# EAGLE design odbConnector (EAGLE 5.12)
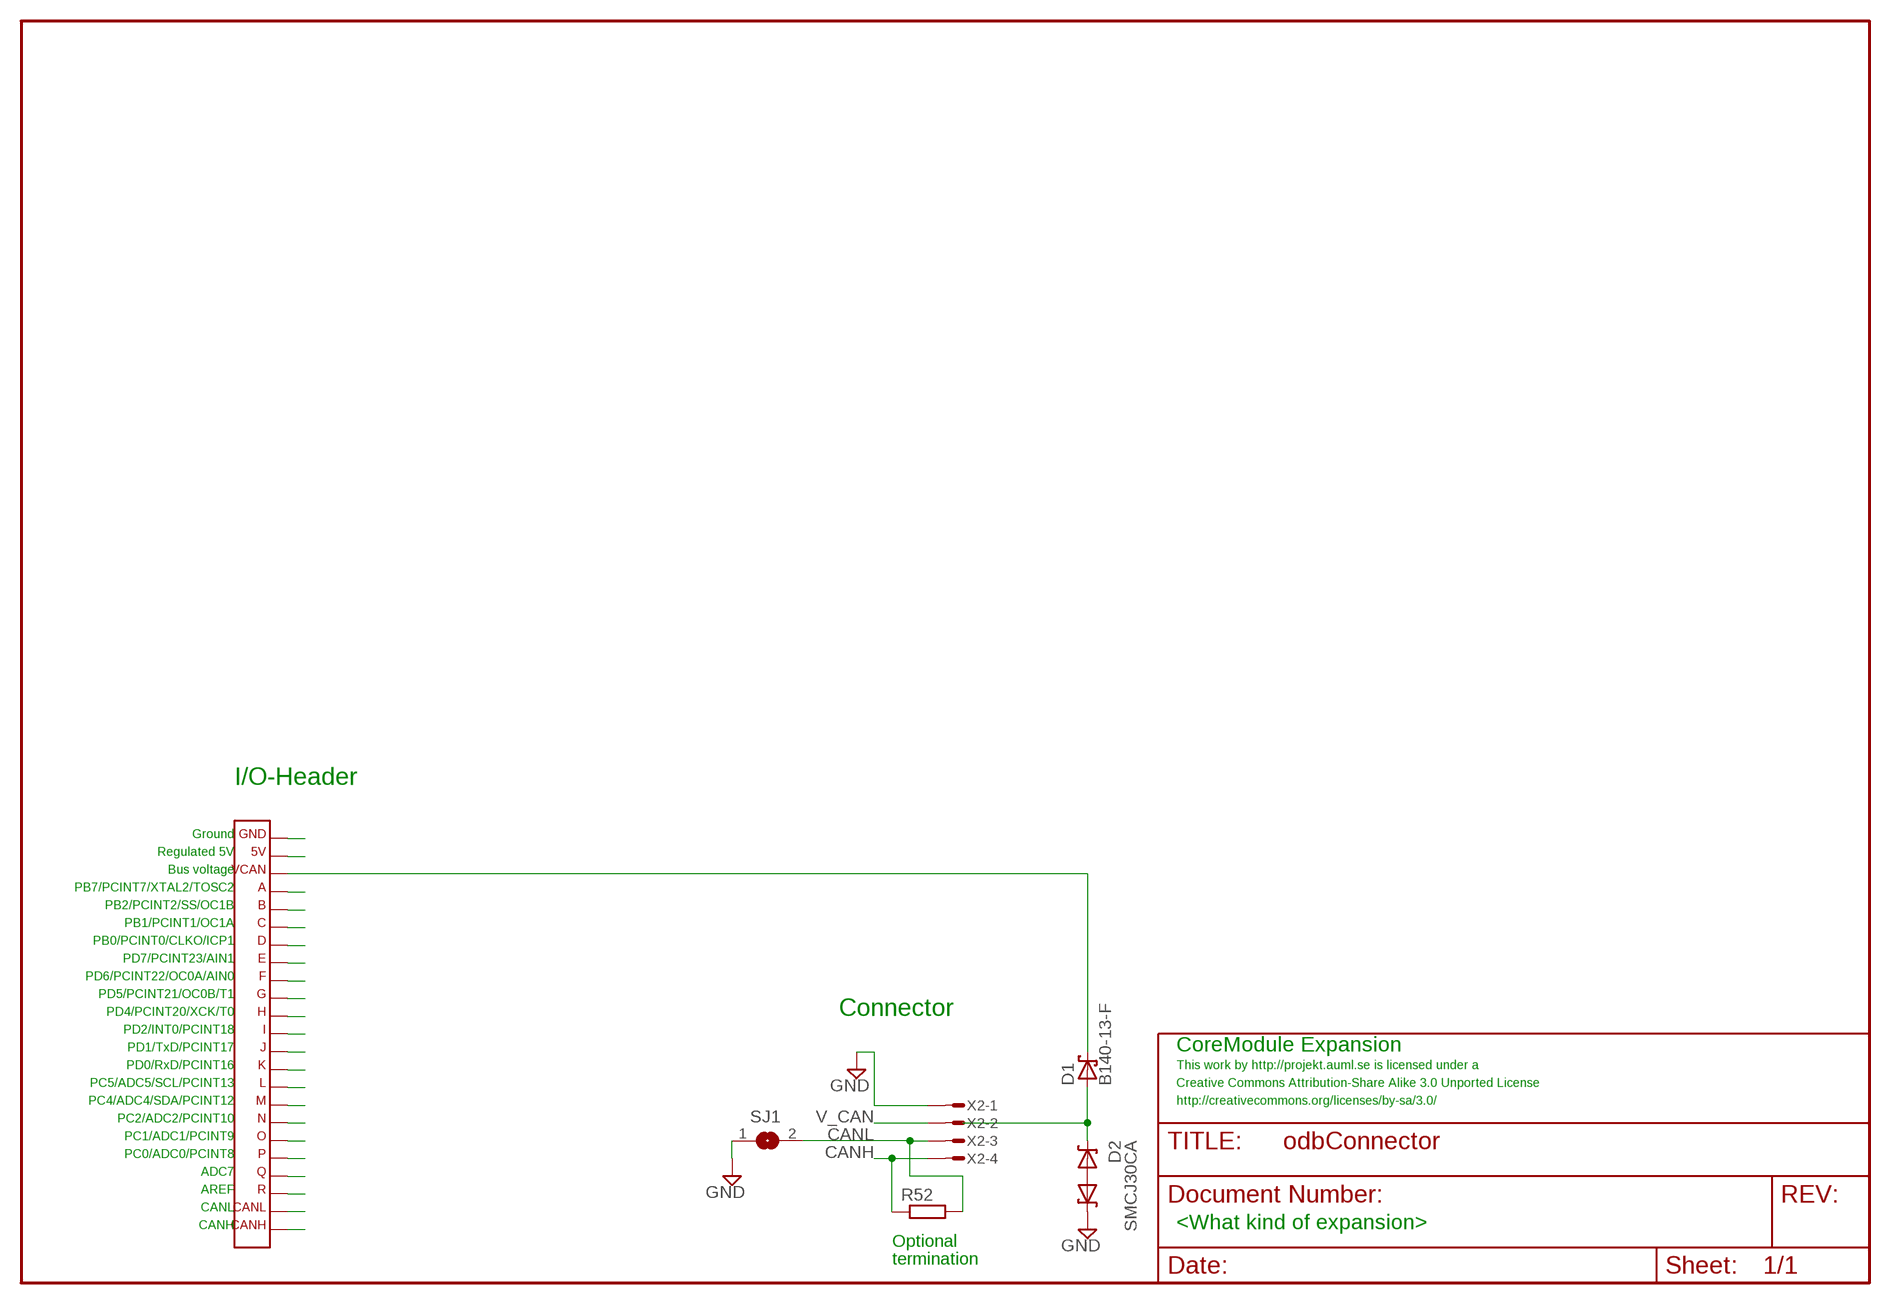
[diagram p0: schematic, sheet 1]

## Parts
D1  B140-13-F  SCHOTTKY-DIODESMA  [SMA]
D2  SMCJ30CA  TVS2SMC  [SMC]
R52  R-EUR0603  [R0603]
SJ1  SJ_NO  [SJ_NO]
X1  CORETWO_LAYOUTISPHOLES  [CORETWO_LAYOUT_ISPHOLES]
X2  MICROMATCH-4  [MICROMATCH-4]

## Nets
CANH: R52.1 X1.CANH X2.4
CANL: R52.2 SJ1.2 X1.CANL X2.3
EXP_A: X1.A
EXP_B: X1.B
EXP_C: X1.C
EXP_D: X1.D
EXP_E: X1.E
EXP_F: X1.F
EXP_G: X1.G
EXP_H: X1.H
EXP_I: X1.I
EXP_J: X1.J
EXP_K: X1.K
EXP_L: X1.L
EXP_M: X1.M
EXP_N: X1.N
EXP_O: X1.O
EXP_P: X1.P
EXP_Q: X1.Q
EXP_R: X1.R
GND: D2.A(C1) SJ1.1 X1.GND X2.1
V_CAN: D1.A D2.C(C2) X2.2
V_CAN_PROT: D1.C X1.VCAN
VCC: X1.5V

## Notes on the sheet
- I/O-Header
- Ground
- Regulated 5V
- Bus voltage
- PB7/PCINT7/XTAL2/TOSC2
- PB2/PCINT2/SS/OC1B
- PB1/PCINT1/OC1A
- PB0/PCINT0/CLKO/ICP1
- PD7/PCINT23/AIN1
- PD6/PCINT22/OC0A/AIN0
- PD5/PCINT21/OC0B/T1
- PD4/PCINT20/XCK/T0 | Connector
- PD2/INT0/PCINT18
- PD1/TxD/PCINT17 | CoreModule Expansion
- PD0/RxD/PCINT16 | This work by http://projekt.auml.se is licensed under a
- PC5/ADC5/SCL/PCINT13 | Creative Commons Attribution-Share Alike 3.0 Unported License
- PC4/ADC4/SDA/PCINT12 | http://creativecommons.org/licenses/by-sa/3.0/
- PC2/ADC2/PCINT10
- PC1/ADC1/PCINT9
- PC0/ADC0/PCINT8
- ADC7
- AREF
- CANL
- CANH | <What kind of expansion>
- Optional
- termination

## Library data of the parts
D1 = diode:SCHOTTKY-DIODE
D2 = diode:TVS2
R52 = rcl:R-EU
SJ1 = jumper:SJ_NO
X1 = expboard:CORETWO_LAYOUT
X2 = con-amp-micromatch:MICROMATCH-4: MicroMaTch 4 7-215464-4 / 0-215464-4 Drawing Number C-215464 DDEController.pdf

## Board
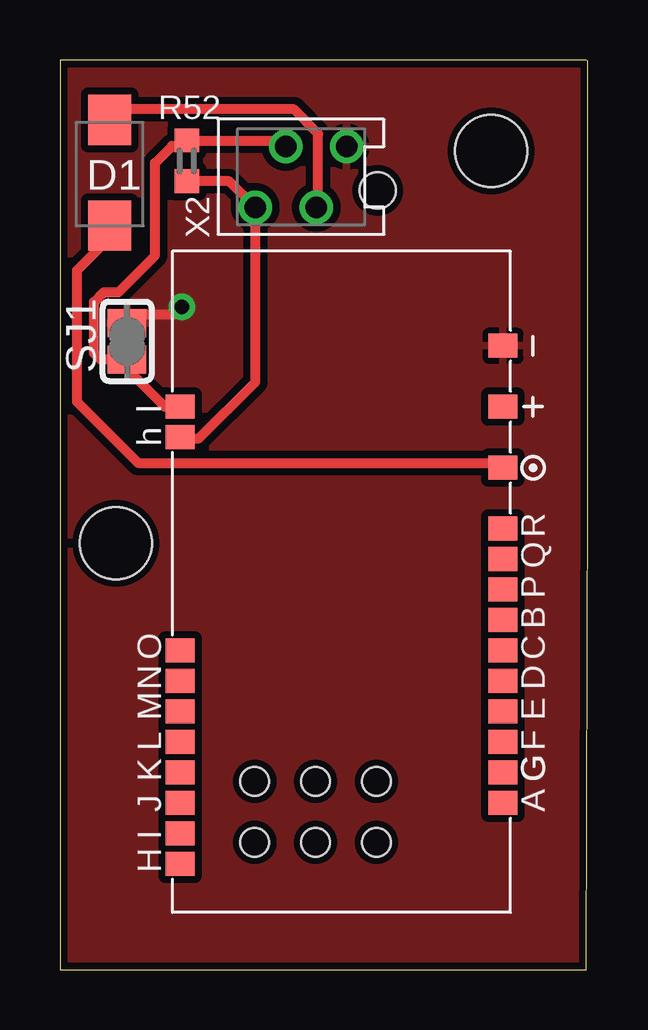
[diagram p1: board, top side]
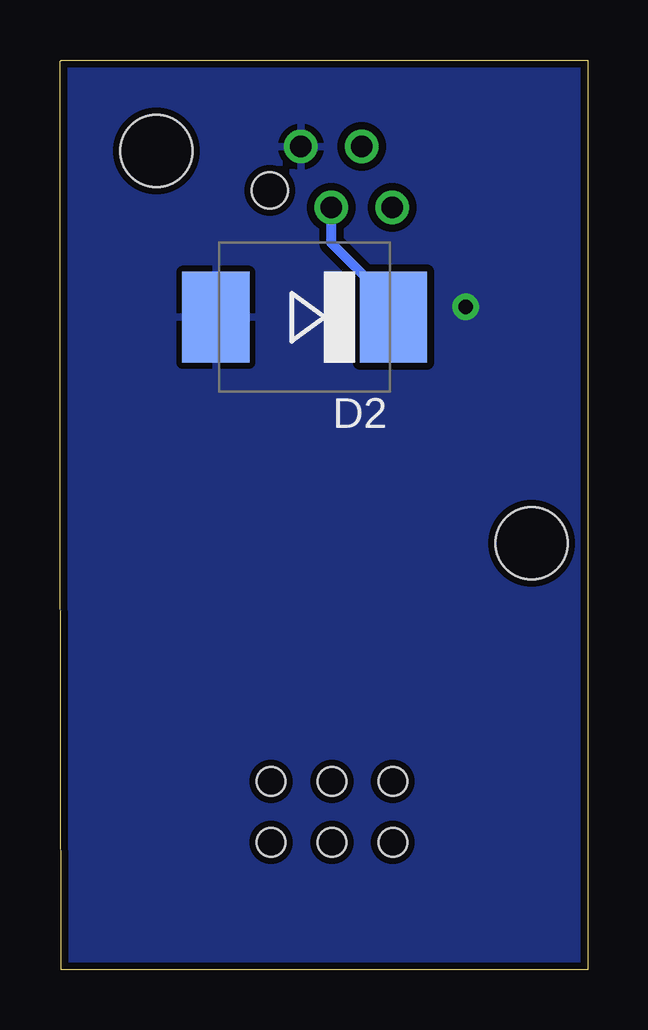
[diagram p2: board, bottom side, seen from below]

Size 22 x 37.92 mm. Coordinates in mm from the lower left corner, seen from the top.
Outline: 0,0 21.94,0 22,20 22,37.87 21.94,37.92 0,37.92 0,0
Copper layers (1*16): Top 0.035mm / dielectric 1.5mm / Bottom 0.035mm
Design rules "default": minimum track width 10mil, minimum drill 0.4mm, track to track 10mil, track to pad 10mil, pad to pad 10mil, via to via 10mil, smd to smd 8mil, copper to edge 10mil, drill to drill 8mil, minimum pad ring 10mil, minimum via ring 10mil, stop-mask expansion 4mil, vias tented up to drill 18mil, thermal gap 10mil
Holes 3 mm at 17.98,34.14 2.34,17.78

### Footprints (pad centres in the part's own frame; a part is rotated, then mirrored left to right if it is on the bottom)
SMA = smd 2.1 x 1.8: A 2.1,0; C -2.3,0
SMC = smd 2.8 x 3.8: A 3.7,0; C -3.7,0
R0603 = smd 0.991 x 1.016: 1 -0.85,0; 2 0.85,0
SJ_NO = smd 1.168 x 1.6: 1 -0.762,0; 2 0.762,0
CORETWO_LAYOUT_ISPHOLES = smd 1 x 1.2: 5V 17.78,0.362; A 1.27,0.362; B 8.89,0.362; C 7.62,0.362; CANH 16.51,13.824; CANL 17.78,13.824; D 6.35,0.362; E 5.08,0.362; F 3.81,0.362; G 2.54,0.362; GND 20.32,0.362; H -1.27,13.824; I 0,13.824; J 1.27,13.824; K 2.54,13.824; L 3.81,13.824; M 5.08,13.824; N 6.35,13.824; O 7.62,13.824; P 10.16,0.362; Q 11.43,0.362; R 12.7,0.362; VCAN 15.24,0.362 | hole 1.2: -0.381,10.719; 2.159,10.719; -0.381,8.179; -0.381,5.639; 2.159,8.179; 2.159,5.639
MICROMATCH-4 = drill 0.9 round: 1 1.905,1.27; 2 0.635,-1.27; 3 -0.635,1.27; 4 -1.905,-1.27 | hole 1.5: 3.199,-0.562

### Placement (x,y rotation side)
D1  2.07,33.32 90 top
D2  11.8,27.2 180 bottom
R52  5.29,33.72 90 top
SJ1  2.8,26.2 270 top
X1  18.84,5.69 90 top
X2  10.05,33.05 0 top

### Tracks (layer width: path | path; a pad name or v marks a point on that pad's centre or on a via)
CANH
  Top 0.406: R52.1 7.06,32.87 X2.4 8.15,24.5 5.79,22.15 5.07,22.15 X1.CANH
CANL
  Top 0.406: X1.CANL 4.37,23.47 2.8,25.04 SJ1.2 1.69,25.44 1.42,25.7 1.42,27.84 1.83,28.25 2.44,28.25 3.96,29.77 3.96,33.63 4.67,34.34 5.06,34.34 R52.2 | X2.3 9.17,34.57 R52.2 | R52.2 5.16,34.44
GND  (via drill 0.6)
  Top 0.406: SJ1.1 3.17,27.33 4.78,27.33 v5.08,27.64
  Bottom 0.406: v5.08,27.64 5.08,27.84
  pour Bottom (isolate 0.305, rank 3): 0,37.92 21.94,37.92 arc-90 22,37.87 21.94,0 0,0
  pour Top (isolate 0.305, rank 3): 0,37.92 21.94,37.92 21.94,0 0,0
V_CAN
  Top 0.406: D1.A 2.09,35.42 2.54,35.87 9.75,35.87 10.77,34.85 10.77,31.86 X2.2
  Bottom 0.406: D2.C 9.04,27.2 9.04,28.71 9.14,28.75 10.69,30.3 X2.2
V_CAN_PROT
  Top 0.406: D1.C 2.07,30.52 0.71,29.16 0.71,23.67 3.25,21.13 18.27,21.13 X1.VCAN

### Text on the board
Document: Creative Commons Attribution-Share Alike 3.0 Unported License | This work by http://projekt.auml.se is licensed under a | http://creativecommons.org/licenses/by-sa/3.0/